# EAGLE schematic untitled (EAGLE 9.6.2)
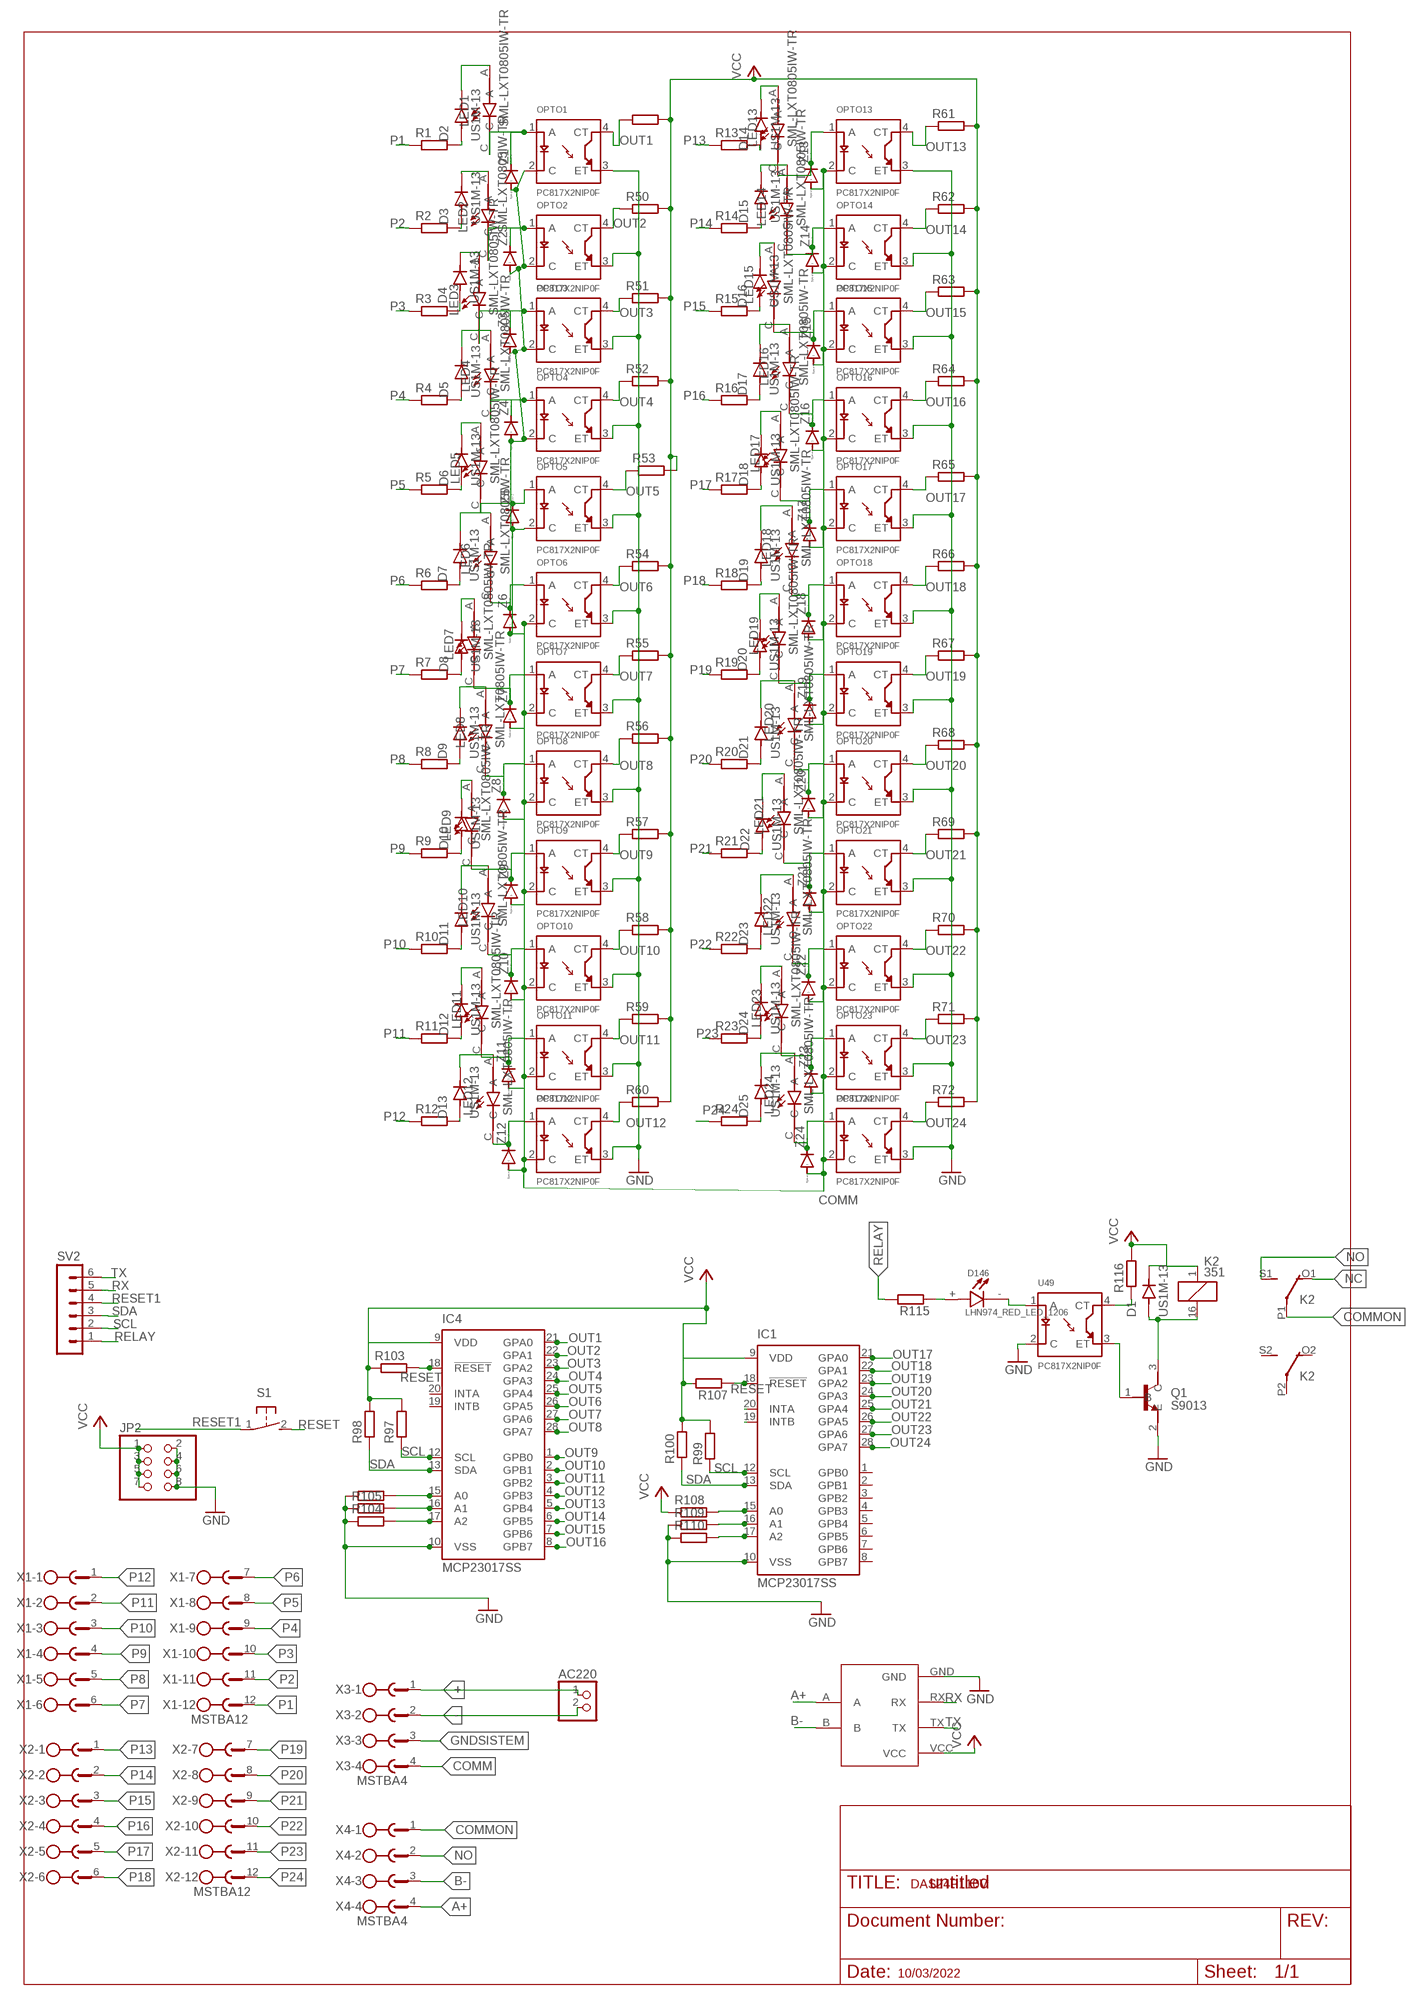
[diagram p0: schematic, sheet 1]

## Parts
AC220  PINHD-1X2  [1X02]
D1  US1M-13  [DIOM5226X240N]
D2  US1M-13  [DIOM5226X240N]
D3  US1M-13  [DIOM5226X240N]
D4  US1M-13  [DIOM5226X240N]
D5  US1M-13  [DIOM5226X240N]
D6  US1M-13  [DIOM5226X240N]
D7  US1M-13  [DIOM5226X240N]
D8  US1M-13  [DIOM5226X240N]
D9  US1M-13  [DIOM5226X240N]
D10  US1M-13  [DIOM5226X240N]
D11  US1M-13  [DIOM5226X240N]
D12  US1M-13  [DIOM5226X240N]
D13  US1M-13  [DIOM5226X240N]
D14  US1M-13  [DIOM5226X240N]
D15  US1M-13  [DIOM5226X240N]
D16  US1M-13  [DIOM5226X240N]
D17  US1M-13  [DIOM5226X240N]
D18  US1M-13  [DIOM5226X240N]
D19  US1M-13  [DIOM5226X240N]
D20  US1M-13  [DIOM5226X240N]
D21  US1M-13  [DIOM5226X240N]
D22  US1M-13  [DIOM5226X240N]
D23  US1M-13  [DIOM5226X240N]
D24  US1M-13  [DIOM5226X240N]
D25  US1M-13  [DIOM5226X240N]
D146  LHN974_RED_LED_1206  [LEDC3216X120N]
IC1  MCP23017SS  [SSOP28DB]
IC4  MCP23017SS  [SSOP28DB]
JP2  PINHD-2X4  [2X04]
K2  351  [351]
LED1  SML-LXT0805IW-TR  [LEDC2012X120N]
LED2  SML-LXT0805IW-TR  [LEDC2012X120N]
LED3  SML-LXT0805IW-TR  [LEDC2012X120N]
LED4  SML-LXT0805IW-TR  [LEDC2012X120N]
LED5  SML-LXT0805IW-TR  [LEDC2012X120N]
LED6  SML-LXT0805IW-TR  [LEDC2012X120N]
LED7  SML-LXT0805IW-TR  [LEDC2012X120N]
LED8  SML-LXT0805IW-TR  [LEDC2012X120N]
LED9  SML-LXT0805IW-TR  [LEDC2012X120N]
LED10  SML-LXT0805IW-TR  [LEDC2012X120N]
LED11  SML-LXT0805IW-TR  [LEDC2012X120N]
LED12  SML-LXT0805IW-TR  [LEDC2012X120N]
LED13  SML-LXT0805IW-TR  [LEDC2012X120N]
LED14  SML-LXT0805IW-TR  [LEDC2012X120N]
LED15  SML-LXT0805IW-TR  [LEDC2012X120N]
LED16  SML-LXT0805IW-TR  [LEDC2012X120N]
LED17  SML-LXT0805IW-TR  [LEDC2012X120N]
LED18  SML-LXT0805IW-TR  [LEDC2012X120N]
LED19  SML-LXT0805IW-TR  [LEDC2012X120N]
LED20  SML-LXT0805IW-TR  [LEDC2012X120N]
LED21  SML-LXT0805IW-TR  [LEDC2012X120N]
LED22  SML-LXT0805IW-TR  [LEDC2012X120N]
LED23  SML-LXT0805IW-TR  [LEDC2012X120N]
LED24  SML-LXT0805IW-TR  [LEDC2012X120N]
OPTO1  PC817X2NIP0F  [SOT254P975X400-4N]
OPTO2  PC817X2NIP0F  [SOT254P975X400-4N]
OPTO3  PC817X2NIP0F  [SOT254P975X400-4N]
OPTO4  PC817X2NIP0F  [SOT254P975X400-4N]
OPTO5  PC817X2NIP0F  [SOT254P975X400-4N]
OPTO6  PC817X2NIP0F  [SOT254P975X400-4N]
OPTO7  PC817X2NIP0F  [SOT254P975X400-4N]
OPTO8  PC817X2NIP0F  [SOT254P975X400-4N]
OPTO9  PC817X2NIP0F  [SOT254P975X400-4N]
OPTO10  PC817X2NIP0F  [SOT254P975X400-4N]
OPTO11  PC817X2NIP0F  [SOT254P975X400-4N]
OPTO12  PC817X2NIP0F  [SOT254P975X400-4N]
OPTO13  PC817X2NIP0F  [SOT254P975X400-4N]
OPTO14  PC817X2NIP0F  [SOT254P975X400-4N]
OPTO15  PC817X2NIP0F  [SOT254P975X400-4N]
OPTO16  PC817X2NIP0F  [SOT254P975X400-4N]
OPTO17  PC817X2NIP0F  [SOT254P975X400-4N]
OPTO18  PC817X2NIP0F  [SOT254P975X400-4N]
OPTO19  PC817X2NIP0F  [SOT254P975X400-4N]
OPTO20  PC817X2NIP0F  [SOT254P975X400-4N]
OPTO21  PC817X2NIP0F  [SOT254P975X400-4N]
OPTO22  PC817X2NIP0F  [SOT254P975X400-4N]
OPTO23  PC817X2NIP0F  [SOT254P975X400-4N]
OPTO24  PC817X2NIP0F  [SOT254P975X400-4N]
Q1  S9013  [SOT95P240X120-3N]
R1  R-EU_0414/15  [0414/15]
R2  R-EU_0414/15  [0414/15]
R3  R-EU_0414/15  [0414/15]
R4  R-EU_0414/15  [0414/15]
R5  R-EU_0414/15  [0414/15]
R6  R-EU_0414/15  [0414/15]
R7  R-EU_0414/15  [0414/15]
R8  R-EU_0414/15  [0414/15]
R9  R-EU_0414/15  [0414/15]
R10  R-EU_0414/15  [0414/15]
R11  R-EU_0414/15  [0414/15]
R12  R-EU_0414/15  [0414/15]
R13  R-EU_0414/15  [0414/15]
R14  R-EU_0414/15  [0414/15]
R15  R-EU_0414/15  [0414/15]
R16  R-EU_0414/15  [0414/15]
R17  R-EU_0414/15  [0414/15]
R18  R-EU_0414/15  [0414/15]
R19  R-EU_0414/15  [0414/15]
R20  R-EU_0414/15  [0414/15]
R21  R-EU_0414/15  [0414/15]
R22  R-EU_0414/15  [0414/15]
R23  R-EU_0414/15  [0414/15]
R24  R-EU_0414/15  [0414/15]
R49  R-EU_R0805  [R0805]
R50  R-EU_R0805  [R0805]
R51  R-EU_R0805  [R0805]
R52  R-EU_R0805  [R0805]
R53  R-EU_R0805  [R0805]
R54  R-EU_R0805  [R0805]
R55  R-EU_R0805  [R0805]
R56  R-EU_R0805  [R0805]
R57  R-EU_R0805  [R0805]
R58  R-EU_R0805  [R0805]
R59  R-EU_R0805  [R0805]
R60  R-EU_R0805  [R0805]
R61  R-EU_R0805  [R0805]
R62  R-EU_R0805  [R0805]
R63  R-EU_R0805  [R0805]
R64  R-EU_R0805  [R0805]
R65  R-EU_R0805  [R0805]
R66  R-EU_R0805  [R0805]
R67  R-EU_R0805  [R0805]
R68  R-EU_R0805  [R0805]
R69  R-EU_R0805  [R0805]
R70  R-EU_R0805  [R0805]
R71  R-EU_R0805  [R0805]
R72  R-EU_R0805  [R0805]
R97  R-EU_R0805  [R0805]
R98  R-EU_R0805  [R0805]
R99  R-EU_R0805  [R0805]
R100  R-EU_R0805  [R0805]
R103  R-EU_R0805  [R0805]
R104  R-EU_R0805  [R0805]
R105  R-EU_R0805  [R0805]
R106  R-EU_R0805  [R0805]
R107  R-EU_R0805  [R0805]
R108  R-EU_R0805  [R0805]
R109  R-EU_R0805  [R0805]
R110  R-EU_R0805  [R0805]
R115  R-EU_R0805  [R0805]
R116  R-EU_R0805  [R0805]
S1  31-XX  [B3F-31XX]
SV2  MA06-1  [MA06-1]
TTL-RS1  TTL-RS485  [TTL-RS485]
U49  PC817X2NIP0F  [SOT254P975X400-4N]
X1  MSTBA12  [MSTBA12]
X2  MSTBA12  [MSTBA12]
X3  MSTBA4  [MSTBA4]
X4  MSTBA4  [MSTBA4]
Z1  DIODE-SOD123  [SOD123]
Z2  DIODE-SOD123  [SOD123]
Z3  DIODE-SOD123  [SOD123]
Z4  DIODE-SOD123  [SOD123]
Z5  DIODE-SOD123  [SOD123]
Z6  DIODE-SOD123  [SOD123]
Z7  DIODE-SOD123  [SOD123]
Z8  DIODE-SOD123  [SOD123]
Z9  DIODE-SOD123  [SOD123]
Z10  DIODE-SOD123  [SOD123]
Z11  DIODE-SOD123  [SOD123]
Z12  DIODE-SOD123  [SOD123]
Z13  DIODE-SOD123  [SOD123]
Z14  DIODE-SOD123  [SOD123]
Z15  DIODE-SOD123  [SOD123]
Z16  DIODE-SOD123  [SOD123]
Z17  DIODE-SOD123  [SOD123]
Z18  DIODE-SOD123  [SOD123]
Z19  DIODE-SOD123  [SOD123]
Z20  DIODE-SOD123  [SOD123]
Z21  DIODE-SOD123  [SOD123]
Z22  DIODE-SOD123  [SOD123]
Z23  DIODE-SOD123  [SOD123]
Z24  DIODE-SOD123  [SOD123]

## Nets
+: AC220.1 X3.1
-: AC220.2 X3.2
A+: TTL-RS1.A X4.4
B-: TTL-RS1.B X4.3
COMM: OPTO1.2(C) OPTO2.2(C) OPTO3.2(C) OPTO4.2(C) OPTO5.2(C) OPTO6.2(C) OPTO7.2(C) OPTO8.2(C) OPTO9.2(C) OPTO10.2(C) OPTO11.2(C) OPTO12.2(C) OPTO13.2(C) OPTO14.2(C) OPTO15.2(C) OPTO16.2(C) OPTO17.2(C) OPTO18.2(C) OPTO19.2(C) OPTO20.2(C) OPTO21.2(C) OPTO22.2(C) OPTO23.2(C) OPTO24.2(C) X3.4 Z1.A Z2.A Z3.A Z4.A Z5.A Z6.A Z7.A Z8.A Z9.A Z10.A Z11.A Z12.A Z13.A Z14.A Z15.A Z16.A Z17.A Z18.A Z19.A Z20.A Z21.A Z22.A Z23.A Z24.A
COMMON: K2.P1(2:P) X4.1
GND: IC1.10(VSS) IC4.10(VSS) JP2.2 JP2.4 JP2.6 JP2.8 OPTO1.3(ET) OPTO2.3(ET) OPTO3.3(ET) OPTO4.3(ET) OPTO5.3(ET) OPTO6.3(ET) OPTO7.3(ET) OPTO8.3(ET) OPTO9.3(ET) OPTO10.3(ET) OPTO11.3(ET) OPTO12.3(ET) OPTO13.3(ET) OPTO14.3(ET) OPTO15.3(ET) OPTO16.3(ET) OPTO17.3(ET) OPTO18.3(ET) OPTO19.3(ET) OPTO20.3(ET) OPTO21.3(ET) OPTO22.3(ET) OPTO23.3(ET) OPTO24.3(ET) Q1.2(E) R104.1 R105.1 R106.1 R109.1 R110.1 TTL-RS1.GND U49.2(C)
GNDSISTEM: X3.3
N$1: D2.A R1.2
N$2: LED10.C OPTO10.1(A) Z10.C
N$3: D3.A R2.2
N$5: D4.A R3.2
N$6: LED1.C OPTO1.1(A) Z1.C
N$7: D5.A R4.2
N$8: D2.C(K) LED1.A
N$9: D6.A R5.2
N$10: D3.C(K) LED2.A
N$11: D7.A R6.2
N$12: LED2.C OPTO2.1(A) Z2.C
N$13: D8.A R7.2
N$14: D4.C(K) LED3.A
N$15: D9.A R8.2
N$16: LED3.C OPTO3.1(A) Z3.C
N$17: D15.A R14.2
N$18: D5.C(K) LED4.A
N$19: LED4.C OPTO4.1(A) Z4.C
N$20: D10.A R9.2
N$21: D6.C(K) LED5.A
N$22: LED5.C OPTO5.1(A) Z5.C
N$23: D7.C(K) LED6.A
N$24: D11.A R10.2
N$25: D8.C(K) LED7.A
N$26: LED6.C OPTO6.1(A) Z6.C
N$28: D12.A R11.2
N$36: D13.A R12.2
N$40: D14.A R13.2
N$44: D16.A R15.2
N$48: D17.A R16.2
N$49: D9.C(K) LED8.A
N$50: D10.C(K) LED9.A
N$51: D11.C(K) LED10.A
N$52: D18.A R17.2
N$53: D12.C(K) LED11.A
N$54: D13.C(K) LED12.A
N$55: D14.C(K) LED13.A
N$56: D19.A R18.2
N$57: D15.C(K) LED14.A
N$58: D16.C(K) LED15.A
N$59: D17.C(K) LED16.A
N$60: D20.A R19.2
N$61: D18.C(K) LED17.A
N$62: D19.C(K) LED18.A
N$63: D20.C(K) LED19.A
N$64: D21.C(K) LED20.A
N$65: D22.C(K) LED21.A
N$66: D21.A R20.2
N$67: D23.C(K) LED22.A
N$68: D24.C(K) LED23.A
N$69: D25.C(K) LED24.A
N$70: LED7.C OPTO7.1(A) Z7.C
N$71: D22.A R21.2
N$72: LED8.C OPTO8.1(A) Z8.C
N$73: LED9.C OPTO9.1(A) Z9.C
N$74: LED11.C OPTO11.1(A) Z11.C
N$75: LED12.C OPTO12.1(A) Z12.C
N$76: D23.A R22.2
N$77: LED13.C OPTO13.1(A) Z13.C
N$78: LED14.C OPTO14.1(A) Z14.C
N$79: LED15.C OPTO15.1(A) Z15.C
N$80: D24.A R23.2
N$81: LED16.C OPTO16.1(A) Z16.C
N$82: LED17.C OPTO17.1(A) Z17.C
N$83: LED18.C OPTO18.1(A) Z18.C
N$84: D25.A R24.2
N$85: LED19.C OPTO19.1(A) Z19.C
N$86: LED20.C OPTO20.1(A) Z20.C
N$87: LED21.C OPTO21.1(A) Z21.C
N$88: LED22.C OPTO22.1(A) Z22.C
N$89: LED23.C OPTO23.1(A) Z23.C
N$90: LED24.C OPTO24.1(A) Z24.C
N$97: D146.- U49.1(A)
N$98: D146.+ R115.1
N$99: R116.1 U49.4(CT)
N$101: D1.A K2.16 Q1.3(C)
N$102: Q1.1(B) U49.3(ET)
N$107: IC1.15(A0) R108.2
N$108: IC1.16(A1) R109.2
N$109: IC4.15(A0) R106.2
N$110: IC4.16(A1) R105.2
N$111: IC4.17(A2) R104.2
N$113: IC1.17(A2) R110.2
N$135: IC1.20(INTA)
N$136: IC1.19(INTB)
NC: K2.O1(2:O)
NO: K2.S1(2:S) X4.2
OUT1: IC4.21(GPA0) OPTO1.4(CT) R49.1
OUT2: IC4.22(GPA1) OPTO2.4(CT) R50.1
OUT3: IC4.23(GPA2) OPTO3.4(CT) R51.1
OUT4: IC4.24(GPA3) OPTO4.4(CT) R52.1
OUT5: IC4.25(GPA4) OPTO5.4(CT) R53.1
OUT6: IC4.26(GPA5) OPTO6.4(CT) R54.1
OUT7: IC4.27(GPA6) OPTO7.4(CT) R55.1
OUT8: IC4.28(GPA7) OPTO8.4(CT) R56.1
OUT9: IC4.1(GPB0) OPTO9.4(CT) R57.1
OUT10: IC4.2(GPB1) OPTO10.4(CT) R58.1
OUT11: IC4.3(GPB2) OPTO11.4(CT) R59.1
OUT12: IC4.4(GPB3) OPTO12.4(CT) R60.1
OUT13: IC4.5(GPB4) OPTO13.4(CT) R61.1
OUT14: IC4.6(GPB5) OPTO14.4(CT) R62.1
OUT15: IC4.7(GPB6) OPTO15.4(CT) R63.1
OUT16: IC4.8(GPB7) OPTO16.4(CT) R64.1
OUT17: IC1.21(GPA0) OPTO17.4(CT) R65.1
OUT18: IC1.22(GPA1) OPTO18.4(CT) R66.1
OUT19: IC1.23(GPA2) OPTO19.4(CT) R67.1
OUT20: IC1.24(GPA3) OPTO20.4(CT) R68.1
OUT21: IC1.25(GPA4) OPTO21.4(CT) R69.1
OUT22: IC1.26(GPA5) OPTO22.4(CT) R70.1
OUT23: IC1.27(GPA6) OPTO23.4(CT) R71.1
OUT24: IC1.28(GPA7) OPTO24.4(CT) R72.1
P1: R1.1 X1.12
P2: R2.1 X1.11
P3: R3.1 X1.10
P4: R4.1 X1.9
P5: R5.1 X1.8
P6: R6.1 X1.7
P7: R7.1 X1.6
P8: R8.1 X1.5
P9: R9.1 X1.4
P10: R10.1 X1.3
P11: R11.1 X1.2
P12: R12.1 X1.1
P13: R13.1 X2.1
P14: R14.1 X2.2
P15: R15.1 X2.3
P16: R16.1 X2.4
P17: R17.1 X2.5
P18: R18.1 X2.6
P19: R19.1 X2.7
P20: R20.1 X2.8
P21: R21.1 X2.9
P22: R22.1 X2.10
P23: R23.1 X2.11
P24: R24.1 X2.12
RELAY: R115.2 SV2.1
RESET: IC1.18(!RESET) IC4.18(!RESET) R103.2 R107.1 S1.2(S)
RESET1: S1.1(P) SV2.4
RX: SV2.5 TTL-RS1.RX
SCL: IC1.12(SCL) IC4.12(SCL) R97.1 R99.1 SV2.2
SDA: IC1.13(SDA) IC4.13(SDA) R98.1 R100.1 SV2.3
TX: SV2.6 TTL-RS1.TX
VCC: D1.C(K) IC1.9(VDD) IC4.9(VDD) JP2.1 JP2.3 JP2.5 JP2.7 K2.1 R49.2 R50.2 R51.2 R52.2 R53.2 R54.2 R55.2 R56.2 R57.2 R58.2 R59.2 R60.2 R61.2 R62.2 R63.2 R64.2 R65.2 R66.2 R67.2 R68.2 R69.2 R70.2 R71.2 R72.2 R97.2 R98.2 R99.2 R100.2 R103.1 R107.2 R108.1 R116.2 TTL-RS1.VCC
Unconnected: IC1.1(GPB0) IC1.2(GPB1) IC1.3(GPB2) IC1.4(GPB3) IC1.5(GPB4) IC1.6(GPB5) IC1.7(GPB6) IC1.8(GPB7) IC4.19(INTB) IC4.20(INTA) K2.O2(3:O) K2.P2(3:P) K2.S2(3:S)

## Notes on the sheet
- DAS24P110V
- 10/03/2022

## Library data of the parts
AC220 = pinhead:PINHD-1X2: PIN HEADER
D1-D25 = US1M-13:US1M-13: Diode, Fast Recovery, 1a, 1kv, Do-214ac-2, Full Reel Check availability <https://pricing.snapeda.com/parts/US1M-13/Diodes%20Incorporated/view-part?ref=eda>; AVAILABILITY: In Stock; DESCRIPTION: Diode Standard 1000 V 1A Surface Mount SMA; MF: Diodes Incorporated; MP: US1M-13; PACKAGE: DO-214AC-214 Diodes Incorporated; PRICE: None; PURCHASE-URL: https://pricing.snapeda.com/search/part/US1M-13/?ref=eda
D146 = LHN974_RED_LED_1206:LHN974_RED_LED_1206: LED Chip 1206 Check availability <https://pricing.snapeda.com/parts/LHN974%20RED%20LED%201206/Osram/view-part?ref=eda>; AVAILABILITY: Not in stock; DESCRIPTION: 2.6 V Red LED SMD; MF: Osram; MP: LHN974 RED LED 1206; PACKAGE: None; PRICE: None
IC1 IC4 = adafruit_edited:MCP23017: http://ww1.microchip.com/downloads/en/DeviceDoc/21952a.pdf Source: http://ww1.microchip.com/downloads/en/DeviceDoc/21952a.pdf
JP2 = pinhead:PINHD-2X4: PIN HEADER
K2 = relay:351: RELAY 2 x switch, Omron; OC_FARNELL: unknown; OC_NEWARK: unknown
LED1-LED24 = SML-LXT0805IW-TR:SML-LXT0805IW-TR: LED; Luminous Intensity:11µcd; Viewing Angle:140°; Forward Current:30mA; Forward Voltage:2V; Color:Red; LED Color:Red; Leaded Process Compatible:Yes; Lens Color:White; Mounting Type:Surface Mount ;RoHS Compliant: Yes Check availability <https://pricing.snapeda.com/parts/SML-LXT0805IW-TR/Lumex%20Opto/Components/view-part?ref=eda>; AVAILABILITY: In Stock; DESCRIPTION: Red - LED Indication - Discrete 2V 0805 (2012 Metric); MF: Lumex Opto/Components; MP: SML-LXT0805IW-TR; PACKAGE: 0805 Lumex; PRICE: None; PURCHASE-URL: https://pricing.snapeda.com/search/part/SML-LXT0805IW-TR/?ref=eda
OPTO1-OPTO24 U49 = PC817X2NIP0F:PC817X2NIP0F: PC817 Series 1 Channel 80 V 5000 Vrms General Purpose Photocoupler - DIP-4 Check availability <https://pricing.snapeda.com/parts/PC817X2NIP0F/Sharp%20Microelectronics/view-part?ref=eda>; AVAILABILITY: Not in stock; DESCRIPTION: Optoisolator Transistor Output 5000Vrms 1 Channel 4-SMD; MF: Sharp Microelectronics; MP: PC817X2NIP0F; PACKAGE: SMD-4 Sharp Microelectronics; PRICE: None
Q1 = S9013:S9013: SMD Transistors NPN 25V-500mA Check availability <https://pricing.snapeda.com/parts/S9013/JCET/view-part?ref=eda>; AVAILABILITY: Not in stock; DESCRIPTION: Bipolar (BJT) Transistor NPN 20V 500mA 625mW Through Hole TO-92-3; MF: JCET; MP: S9013; PACKAGE: SOT-23-3 JCET; PRICE: None
R1-R24 R49-R72 R97-R100 R103-R110 R115 R116 = rcl:R-EU_: RESISTOR, European symbol; SPICEPREFIX: R
S1 = switch-omron:31-XX: OMRON SWITCH; MPN: B3F-3100; OC_FARNELL: 959704; OC_NEWARK: 36M3582
SV2 = con-lstb:MA06-1: PIN HEADER; OC_FARNELL: unknown; OC_NEWARK: unknown
TTL-RS1 = TTL-RS485:TTL-RS485
X1 X2 = con-phoenix-508:MSTBA12: PHOENIX; MPN: 1757349; OC_FARNELL: 3705250; OC_NEWARK: 71C4169
X3 X4 = con-phoenix-508:MSTBA4: PHOENIX; MF: FARNELL; MPN: 1757268; OC_FARNELL: 3705195; OC_NEWARK: 71C4163
Z1-Z24 = diode:DIODE-: DIODE

## Net classes
0 default: drill 0.3 mm, clearance 0.2 mm